# EAGLE design board (EAGLE 9.4.0)
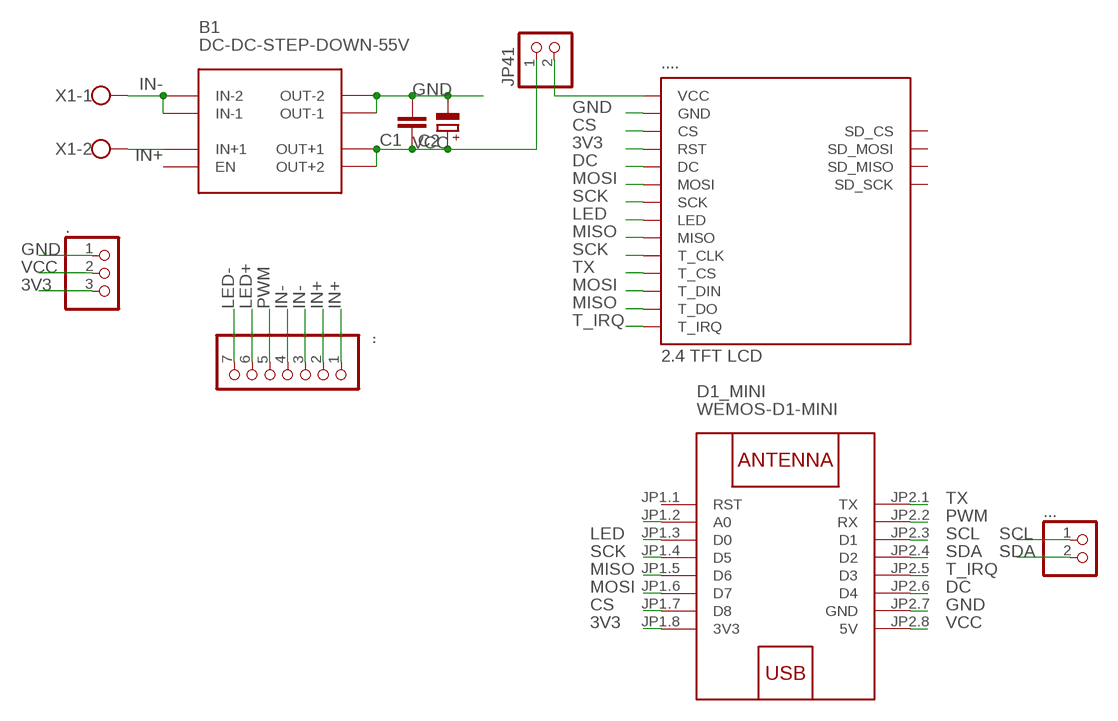
[diagram p0: schematic, sheet 1]

## Parts
.  PINHD-1X3  [1X03]
..  PINHD-1X7  [1X07]
...  PINHD-1X2  [1X02]
....  2.2_TFT_LCD  [2.2_TFT_LCD]
B1  DC-DC-STEP-DOWN-55V  [DC-DC-STEP-DOWN-55V]
C1  C-EUC0805  [C0805]
C2  CPOL-EUE2-5  [E2-5]
D1_MINI  WEMOS-D1-MINI  [WEMOS-D1-MINI]
JP41  PINHD-1X2  [1X02]
X1  W237-102  [W237-102]

## Nets
3V3: ..3 .....RST D1_MINI.JP1.8(3V3)
CS: .....CS D1_MINI.JP1.7(D8)
DC: .....DC D1_MINI.JP2.6(D4)
GND: ..1 .....GND B1.VOUT-1(OUT-1) B1.VOUT-2(OUT-2) C1.2 C2.- D1_MINI.JP2.7(GND)
IN+: ...1 ...2 B1.VIN+(IN+1) X1.2
IN-: ...3 ...4 B1.VIN-1(IN-1) B1.VIN-2(IN-2) X1.1
LED: .....LED D1_MINI.JP1.3(D0)
LED+: ...6
LED-: ...7
MISO: .....MISO .....T_DO D1_MINI.JP1.5(D6)
MOSI: .....MOSI .....T_DIN D1_MINI.JP1.6(D7)
N$1: .....VCC JP41.2
N$17: D1_MINI.JP1.2(A0)
PWM: ...5 D1_MINI.JP2.2(RX)
SCK: .....SCK .....T_CLK D1_MINI.JP1.4(D5)
SCL: ....1 D1_MINI.JP2.3(D1)
SDA: ....2 D1_MINI.JP2.4(D2)
T_IRQ: .....T_IRQ D1_MINI.JP2.5(D3)
TX: .....T_CS D1_MINI.JP2.1(TX)
VCC: ..2 B1.VOUT+1(OUT+1) B1.VOUT+2(OUT+2) C1.1 C2.+ D1_MINI.JP2.8(5V) JP41.1
Unconnected: .....SD_CS .....SD_MISO .....SD_MOSI .....SD_SCK B1.EN D1_MINI.JP1.1(RST)

## Library data of the parts
. = pinhead:PINHD-1X3: PIN HEADER
.. = pinhead:PINHD-1X7: PIN HEADER
... JP41 = pinhead:PINHD-1X2: PIN HEADER
.... = eagle1:2.2_TFT_LCD
B1 = diy-modules:DC-DC-STEP-DOWN-55V
C1 = rcl:C-EU: CAPACITOR, European symbol; SPICEPREFIX: C
C2 = rcl:CPOL-EU: POLARIZED CAPACITOR, European symbol; SPICEPREFIX: C
D1_MINI = diy-modules:WEMOS-D1-MINI: WEMOS D1 mini: Mini Wi-Fi Board based on ESP-8266 device More details can be found here: https://www.wemos.cc/product/d1-mini.html Click here to find device on ebay.com <http://www.ebay.com/sch/wemos+d1+mini+nodemcu>
X1 = con-wago-500:W237-102: WAGO SCREW CLAMP; MPN: 237-102; OC_FARNELL: unknown; OC_NEWARK: 70K9898

## Net classes
0 default: width 0.406 mm, drill 0.406 mm, clearance 0.406 mm

## Board
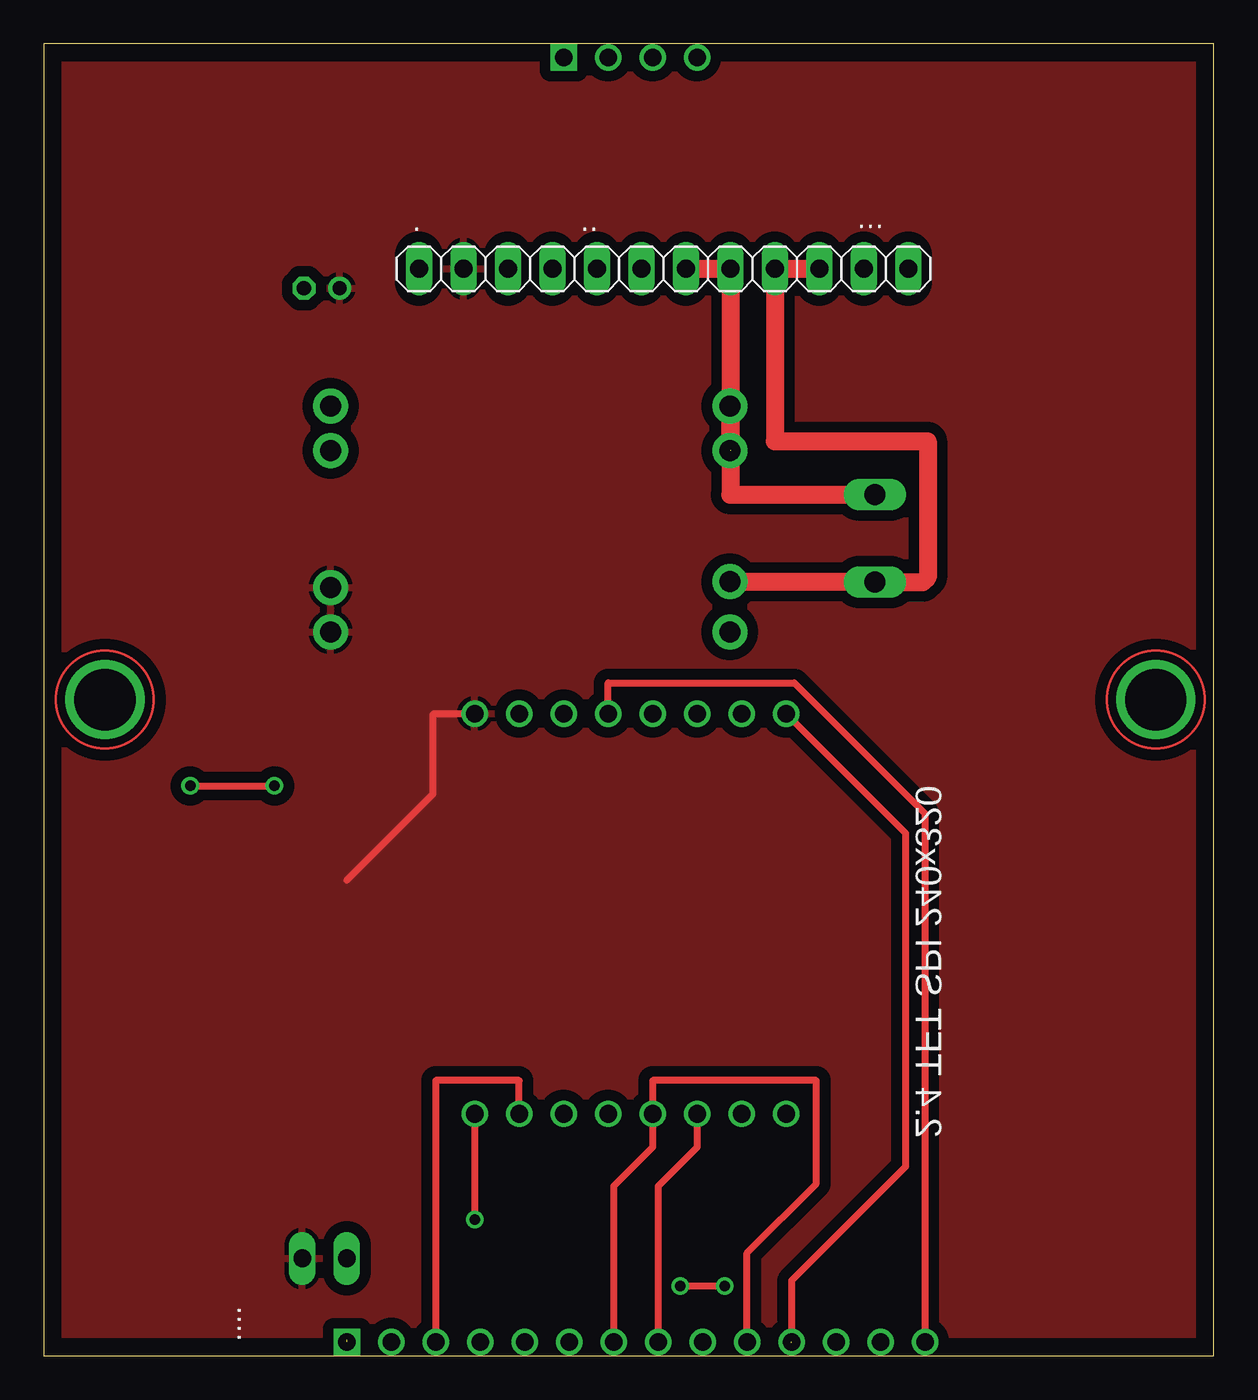
[diagram p1: board, top side]
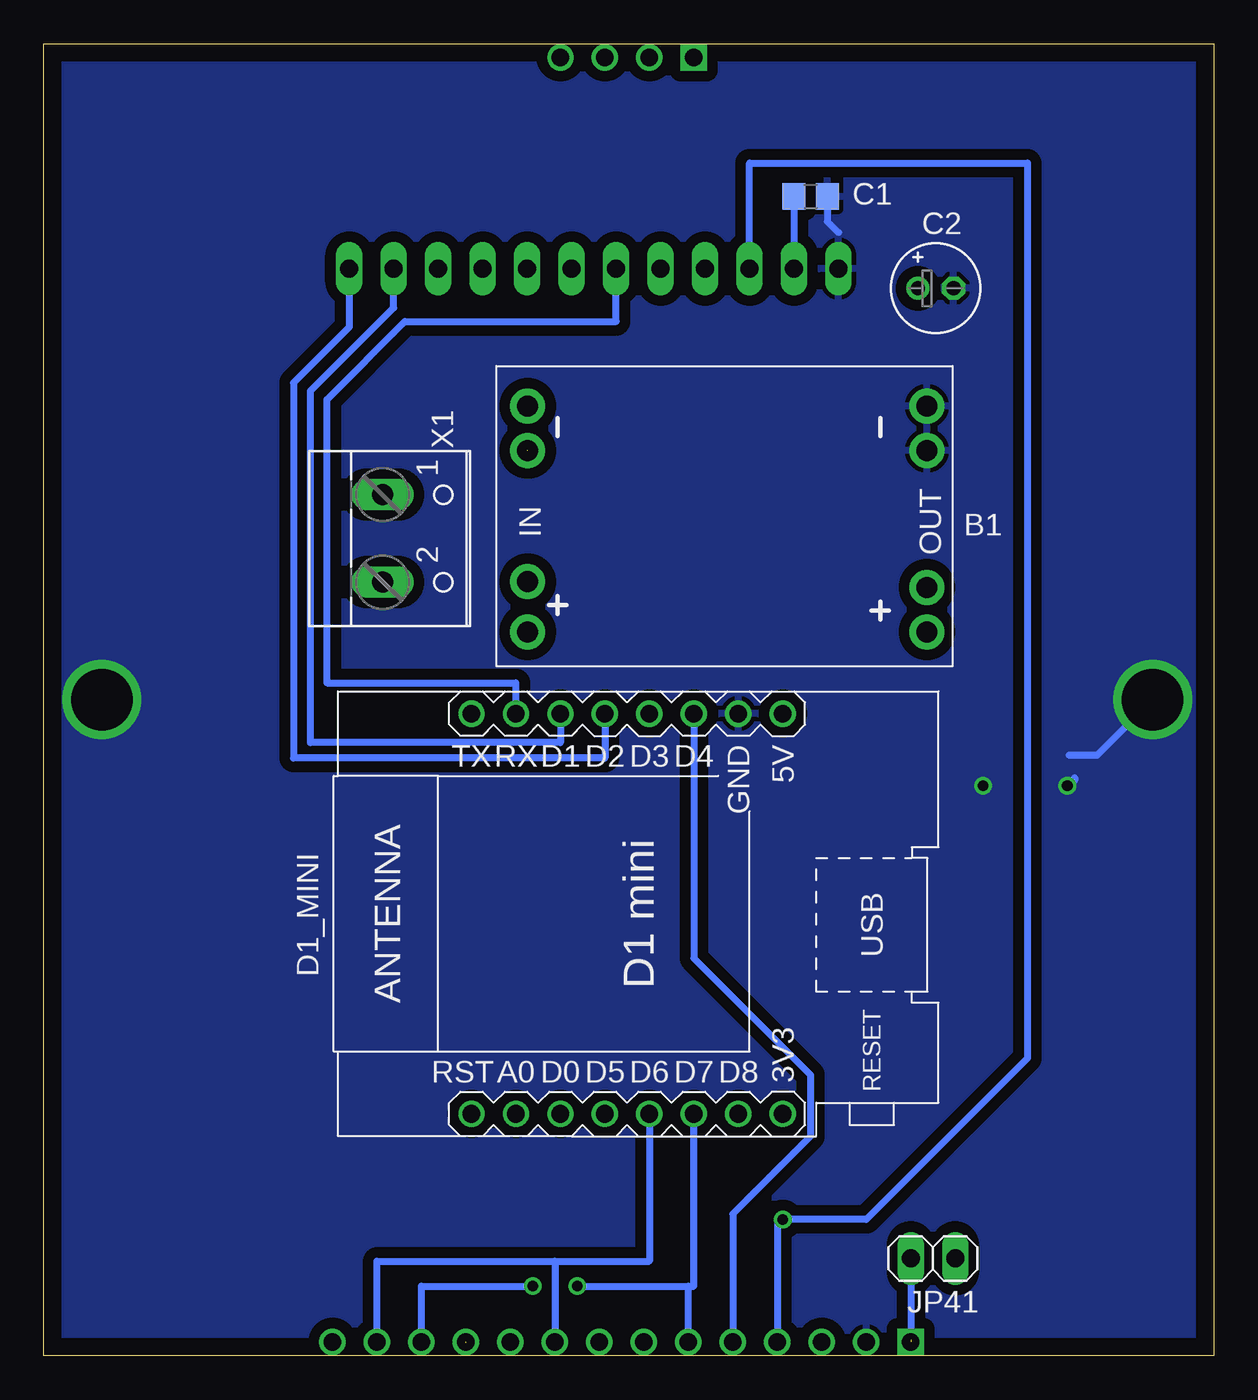
[diagram p2: board, bottom side, seen from below]

Size 66.81 x 74.92 mm. Coordinates in mm from the lower left corner, seen from the top.
Outline: 0,0 66.81,0 66.81,74.92 0,74.92 0,0
Copper layers (1*16): Top 0.035mm / dielectric 1.5mm / Bottom 0.035mm
Design rules "default": minimum track width 6mil, minimum drill 0.35mm, track to track 6mil, track to pad 6mil, pad to pad 6mil, via to via 6mil, smd to smd 6mil, copper to edge 40mil, drill to drill 6mil, minimum pad ring 10mil, minimum via ring 8mil, stop-mask expansion 4mil, vias tented up to drill 0mil, thermal gap 10mil

### Footprints (pad centres in the part's own frame; a part is rotated, then mirrored left to right if it is on the bottom)
1X03 = drill 1.016 long: 1 -2.54,0; 2 0,0; 3 2.54,0
1X07 = drill 1.016 long: 1 -7.62,0; 2 -5.08,0; 3 -2.54,0; 4 0,0; 5 2.54,0; 6 5.08,0; 7 7.62,0
1X02 = drill 1.016 long: 1 -1.27,0; 2 1.27,0
2.2_TFT_LCD = drill 1 pad 1.422: CS 0,-0.318; DC 0,-5.397; GND 0,2.223; LED 0,-13.018; MISO 0,-15.557; MOSI 0,-7.938; RST 0,-2.857; SCK 0,-10.477; SD_MISO 73.343,-12.7; SD_MOSI 73.343,-10.16; SD_SCK 73.343,-15.24; T_CLK 0,-18.098; T_CS 0,-20.637; T_DIN 0,-23.177; T_DO 0,-25.718; T_IRQ 0,-28.258 | drill 1 pad 1.422 square: SD_CS 73.343,-7.62; VCC 0,4.763
DC-DC-STEP-DOWN-55V = drill 1.2 pad 2: EN 15.367,9.461; VIN+ 15.367,6.604; VIN-1 15.367,-3.429; VIN-2 15.367,-0.889; VOUT+1 -7.429,6.921; VOUT+2 -7.429,9.461; VOUT-1 -7.429,-3.429; VOUT-2 -7.429,-0.889
C0805 = smd 1.3 x 1.5: 1 -0.95,0; 2 0.95,0
E2-5 = drill 0.813 pad 1.27: + -1.016,0 | drill 0.813 pad 1.27 octagon: - 1.016,0
WEMOS-D1-MINI = drill 1: JP1.1 -11.43,9.525; JP1.2 -11.43,6.985; JP1.3 -11.43,4.445; JP1.4 -11.43,1.905; JP1.5 -11.43,-0.635; JP1.6 -11.43,-3.175; JP1.7 -11.43,-5.715; JP1.8 -11.43,-8.255; JP2.1 11.43,9.525; JP2.2 11.43,6.985; JP2.3 11.43,4.445; JP2.4 11.43,1.905; JP2.5 11.43,-0.635; JP2.6 11.43,-3.175; JP2.7 11.43,-5.715; JP2.8 11.43,-8.255
W237-102 = drill 1.194 long: 1 -2.5,-1.27; 2 2.5,-1.27

### Placement (x,y rotation side)
.  23.97,62.07 0 top
..  36.67,62.07 180 top
...  48.1,62.07 0 top
....  22.07,0.79 90 top
B1  23.81,50.8 180 bottom
C1  23.02,66.2 0 bottom
C2  15.88,60.96 0 bottom
D1_MINI  32.86,25.24 90 bottom
JP41  16.03,5.56 180 bottom
X1  46.2,46.67 270 bottom

### Tracks (layer width: path | path; a pad name or v marks a point on that pad's centre or on a via)
3V3  (via drill 0.6)
  Top 0.406: D1_MINI.JP1.8 v24.61,7.78
  Bottom 0.406: .....RST 24.92,7.78 v24.61,7.78 19.84,7.78 10.64,16.99 10.64,68.1 26.51,68.1 ..3
CS
  Top 0.406: D1_MINI.JP1.7 27.15,15.72 22.38,15.72 .....CS
DC
  Bottom 0.406: D1_MINI.JP2.6 29.69,22.7 23.02,16.03 23.02,12.54 27.46,8.1 .....DC
GND  (via drill 0.6, 3.5 pad 3)
  Top 0.406: v8.36,32.54 v13.18,32.54
  Bottom 0.406: v3.49,37.46 6.67,34.29 8.25,34.29 | 7.94,33.02 7.94,32.86 8.25,32.54 v8.36,32.54 | C1.2 22.07,64.77 21.43,64.14
  other vias: 63.5,37.46
  pour Bottom (isolate 0.61): -0.79,74.77 -0.79,-0.48 67.47,-0.48 67.47,74.77
IN+
  Top 1.016: ...2 ...1 | ...2 43.5,62.07 | B1.VIN+ 47.44,44.2 X1.2 50.16,44.17 50.19,44.15 50.48,44.45 50.48,52.23 41.75,52.23 ...2
IN-  (1 unrouted)
  Top 1.016: ...4 ...3 39.21,51.69 B1.VIN-2 B1.VIN-1 | 39.21,51.71 39.21,49.17 X1.1
LED
  Top 0.406: D1_MINI.JP1.3 37.31,11.91 35.08,9.68 .....LED
MISO
  Bottom 0.406: D1_MINI.JP1.5 32.23,5.4 37.62,5.4 | 37.62,5.4 .....MISO | .....T_DO 47.78,5.4 37.62,5.4
MOSI  (via drill 0.6)
  Top 0.406: v38.89,3.97 v36.35,3.97
  Bottom 0.406: .....T_DIN 45.24,3.97 v38.89,3.97 | .....MOSI 30,3.97 | D1_MINI.JP1.6 29.69,3.97 30,3.97 | v36.35,3.97 30,3.97
N$1  (1 unrouted)
  Bottom 0.406: JP41.2 17.3,0.9
PWM
  Bottom 0.406: ...5 34.13,59.05 46.2,59.05 50.64,54.61 50.64,38.42 39.85,38.42 D1_MINI.JP2.2
SCK
  Top 0.406: .....SCK 32.54,9.68 34.77,11.91 D1_MINI.JP1.4 34.77,15.72 44.11,15.72 44.11,9.82 40.16,5.87 .....T_CLK
SCL
  Bottom 0.406: D1_MINI.JP2.3 37.31,35 51.59,35 51.59,55.09 46.83,59.85 ....1
SDA
  Bottom 0.406: ....2 49.37,58.74 52.55,55.56 52.55,34.13 34.77,34.13 D1_MINI.JP2.4
T_IRQ
  Top 0.406: D1_MINI.JP2.5 32.23,38.42 42.86,38.42 50.32,30.96 .....T_IRQ
TX  (1 unrouted)
  Top 0.406: D1_MINI.JP2.1 49.21,29.85 49.21,10.79 42.7,4.29 42.7,0.74
VCC
  Top 0.406: 17.3,27.15 22.22,32.07 22.22,36.61 22.29,36.67 D1_MINI.JP2.8
  Bottom 0.406: C1.1 ..2
  pour Top (isolate 0.61): 0.16,76.04 68.9,76.04 68.9,-0.79 0.16,-0.79
(copper drawn outside any net)
  shapes: Top circle x2